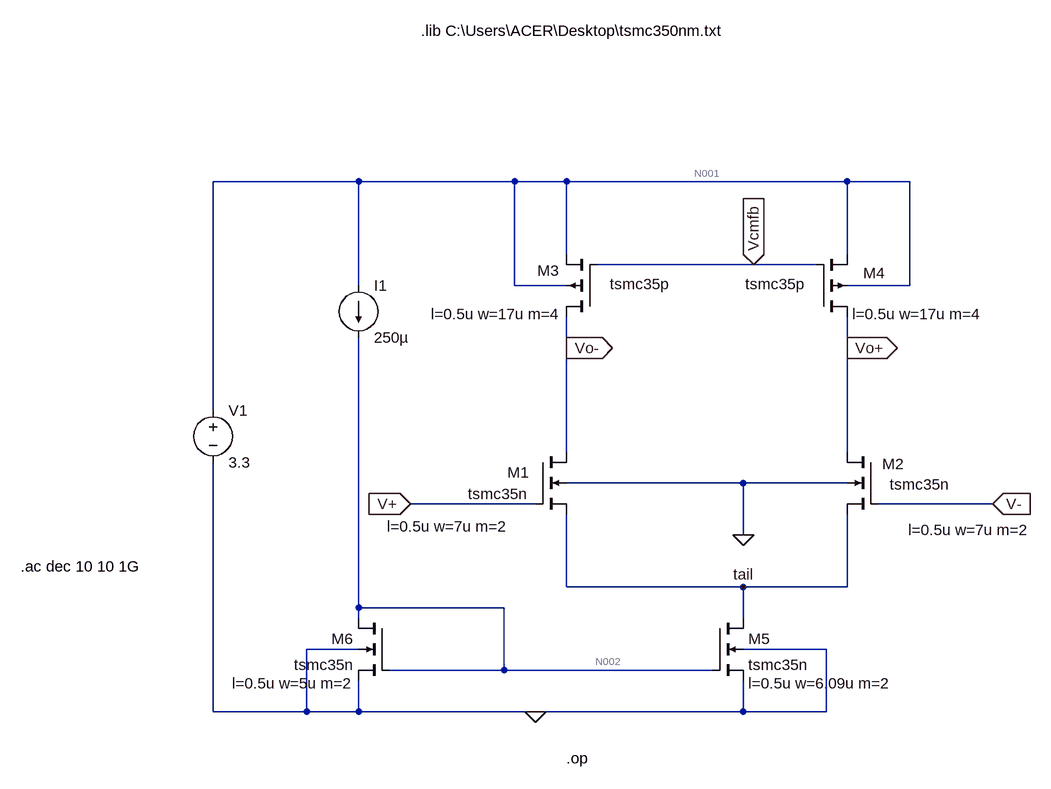
[diagram p0: schematic transconductor.asc]
transconductor.asc, the LTspice schematic file:
Version 4
SHEET 1 1708 2548
WIRE -560 -416 -784 -416
WIRE -320 -416 -560 -416
WIRE -240 -416 -320 -416
WIRE 192 -416 -240 -416
WIRE 288 -416 192 -416
WIRE -240 -304 -240 -416
WIRE 192 -304 192 -416
WIRE 48 -288 -192 -288
WIRE 144 -288 48 -288
WIRE -560 -256 -560 -416
WIRE -320 -256 -320 -416
WIRE -240 -256 -320 -256
WIRE 288 -256 288 -416
WIRE 288 -256 192 -256
WIRE -240 -160 -240 -208
WIRE 192 -160 192 -208
WIRE -784 -64 -784 -416
WIRE -240 0 -240 -160
WIRE 192 0 192 -160
WIRE 32 48 -240 48
WIRE 192 48 32 48
WIRE -288 80 -480 80
WIRE 416 80 240 80
WIRE 32 128 32 48
WIRE -240 208 -240 96
WIRE 32 208 -240 208
WIRE 192 208 192 96
WIRE 192 208 32 208
WIRE -560 240 -560 -176
WIRE -336 240 -560 240
WIRE -560 256 -560 240
WIRE 32 256 32 208
WIRE -560 304 -640 304
WIRE 160 304 32 304
WIRE -336 336 -336 240
WIRE -336 336 -512 336
WIRE -16 336 -336 336
WIRE -784 400 -784 16
WIRE -640 400 -640 304
WIRE -640 400 -784 400
WIRE -560 400 -560 352
WIRE -560 400 -640 400
WIRE -288 400 -560 400
WIRE 32 400 32 352
WIRE 32 400 -288 400
WIRE 160 400 160 304
WIRE 160 400 32 400
FLAG 32 128 0
FLAG -288 400 0
FLAG 32 208 tail
FLAG -480 80 V+
IOPIN -480 80 In
FLAG 416 80 V-
IOPIN 416 80 In
FLAG -240 -160 Vo-
IOPIN -240 -160 Out
FLAG 192 -160 Vo+
IOPIN 192 -160 Out
FLAG 48 -288 Vcmfb
IOPIN 48 -288 In
SYMBOL nmos4 -288 0 R0
WINDOW 123 -228 115 Left 2
WINDOW 0 -43 32 Left 2
WINDOW 3 -104 65 Left 2
SYMATTR Value2 l=0.5u w=7u m=2
SYMATTR InstName M1
SYMATTR Value tsmc35n
SYMBOL nmos4 240 0 M0
WINDOW 123 -233 120 Left 2
WINDOW 0 -40 19 Left 2
WINDOW 3 -109 50 Left 2
SYMATTR Value2 l=0.5u w=7u m=2
SYMATTR InstName M2
SYMATTR Value tsmc35n
SYMBOL pmos4 -192 -208 R180
WINDOW 123 56 4 Left 2
WINDOW 0 59 71 Left 2
WINDOW 3 -110 50 Left 2
SYMATTR Value2 l=0.5u w=17u m=4
SYMATTR InstName M3
SYMATTR Value tsmc35p
SYMBOL pmos4 144 -208 M180
WINDOW 123 56 4 Left 2
WINDOW 0 73 67 Left 2
WINDOW 3 -109 50 Left 2
SYMATTR Value2 l=0.5u w=17u m=4
SYMATTR InstName M4
SYMATTR Value tsmc35p
SYMBOL current -560 -256 R0
WINDOW 123 0 0 Left 0
WINDOW 39 0 0 Left 0
SYMATTR InstName I1
SYMATTR Value 250µ
SYMBOL nmos4 -16 256 R0
WINDOW 123 56 100 Left 2
SYMATTR Value2 l=0.5u w=6.09u m=2
SYMATTR InstName M5
SYMATTR Value tsmc35n
SYMBOL nmos4 -512 256 M0
WINDOW 123 56 100 Left 2
SYMATTR Value2 l=0.5u w=5u m=2
SYMATTR InstName M6
SYMATTR Value tsmc35n
SYMBOL voltage -784 -80 R0
WINDOW 123 0 0 Left 0
WINDOW 39 0 0 Left 0
SYMATTR InstName V1
SYMATTR Value 3.3
TEXT -1080 176 Left 2 !.ac dec 10 10 1G
TEXT -240 472 Left 2 !.op
TEXT -464 -648 Left 2 !.lib C:\\Users\\ACER\\Desktop\\tsmc350nm.txt

The netlist it stands for:
* transconductor.asc
M1 Vo- V+ tail 0 tsmc35n l=0.5u w=7u m=2
M2 Vo+ V- tail 0 tsmc35n l=0.5u w=7u m=2
M3 Vo- Vcmfb N001 N001 tsmc35p l=0.5u w=17u m=4
M4 Vo+ Vcmfb N001 N001 tsmc35p l=0.5u w=17u m=4
I1 N001 N002 250µ
M5 tail N002 0 0 tsmc35n l=0.5u w=6.09u m=2
M6 N002 N002 0 0 tsmc35n l=0.5u w=5u m=2
V1 N001 0 3.3
.model NMOS NMOS
.model PMOS PMOS
.lib standard.mos
.ac dec 10 10 1G
.op
.lib C:\Users\ACER\Desktop\tsmc350nm.txt
.backanno
.end

* Results of the author's LTspice run, read from the files saved beside the schematic
* Operating Point, zero values left out:
*   V(vo-) = 3.3 V
*   V(tail) = 6.156 nV
*   V(vo+) = 3.3 V
*   V(n001) = 3.3 V
*   V(n002) = 1.168 V
*   Id(M4) = -10.76 pA
*   Is(M4) = 10.76 pA
*   Id(M3) = -10.76 pA
*   Is(M3) = 10.76 pA
*   Id(M6) = 250 µA
*   Ib(M6) = -2.355 pA
*   Is(M6) = -250 µA
*   Id(M5) = 8.284 pA
*   Is(M5) = -8.284 pA
*   Id(M2) = 10.76 pA
*   Ib(M2) = -6.62 pA
*   Is(M2) = -4.142 pA
*   Id(M1) = 10.76 pA
*   Ib(M1) = -6.62 pA
*   Is(M1) = -4.142 pA
*   I(I1) = 250 µA
*   I(V1) = -250 µA
* From the log:
*   Semiconductor Device Operating Points:
*                           --- BSIM3 MOSFETS ---
*   Name:        m4          m3          m6          m5          m2
*   Model:     tsmc35p     tsmc35p     tsmc35n     tsmc35n     tsmc35n
*   Id:       -1.08e-11   -1.08e-11    2.50e-04    8.28e-12    1.08e-11
*   Vgs:      -3.30e+00   -3.30e+00    1.17e+00    1.17e+00   -6.16e-09
*   Vds:      -1.33e-09   -1.33e-09    1.17e+00    6.16e-09    3.30e+00
*   Vbs:       0.00e+00    0.00e+00    0.00e+00    0.00e+00   -6.16e-09
*   Vth:      -7.92e-01   -7.92e-01    7.40e-01    7.53e-01    7.28e-01
*   Vdsat:    -1.75e+00   -1.75e+00    3.00e-01    2.93e-01    3.91e-02
*   Gm:        2.48e-12    2.48e-12    1.07e-03    1.88e-11    8.31e-11
*   Gds:       8.08e-03    8.08e-03    2.20e-05    1.35e-03    2.73e-12
*   Gmb        1.17e-12    1.17e-12    2.65e-04    5.14e-12    3.70e-11
*   Cbd:       0.00e+00    0.00e+00    0.00e+00    0.00e+00    0.00e+00
*   Cbs:       0.00e+00    0.00e+00    0.00e+00    0.00e+00    0.00e+00
*   Cgsov:     1.25e-14    1.25e-14    2.63e-15    3.24e-15    4.02e-15
*   Cgdov:     1.25e-14    1.25e-14    2.63e-15    3.24e-15    4.02e-15
*   Cgbov:     2.00e-16    2.00e-16    9.06e-17    9.06e-17    9.06e-17
*   dQgdVgb:   1.54e-13    1.54e-13    2.07e-14    2.96e-14    1.86e-14
*   dQgdVdb:  -7.46e-14   -7.46e-14   -2.54e-15   -1.37e-14   -4.02e-15
*   dQgdVsb:  -7.68e-14   -7.68e-14   -1.66e-14   -1.51e-14   -4.02e-15
*   dQddVgb:  -7.68e-14   -7.68e-14   -8.85e-15   -1.47e-14   -4.02e-15
*   dQddVdb:   6.43e-14    6.43e-14    2.58e-15    1.28e-14    4.02e-15
*   dQddVsb:   2.61e-14    2.61e-14    8.12e-15    5.37e-15    6.37e-21
*   dQbdVgb:  -2.59e-16   -2.59e-16   -2.96e-15   -1.58e-16   -1.06e-14
*   dQbdVdb:  -4.14e-14   -4.14e-14    1.40e-17   -8.63e-15    2.18e-23
*   dQbdVsb:   1.20e-14    1.20e-14   -2.24e-15    1.12e-15    3.46e-19
*   Name:        m1
*   Model:     tsmc35n
*   Id:        1.08e-11
*   Vgs:      -6.16e-09
*   Vds:       3.30e+00
*   Vbs:      -6.16e-09
*   Vth:       7.28e-01
*   Vdsat:     3.91e-02
*   Gm:        8.31e-11
*   Gds:       2.73e-12
*   Gmb        3.70e-11
*   Cbd:       0.00e+00
*   Cbs:       0.00e+00
*   Cgsov:     4.02e-15
*   Cgdov:     4.02e-15
*   Cgbov:     9.06e-17
*   dQgdVgb:   1.86e-14
*   dQgdVdb:  -4.02e-15
*   dQgdVsb:  -4.02e-15
*   dQddVgb:  -4.02e-15
*   dQddVdb:   4.02e-15
*   dQddVsb:   6.37e-21
*   dQbdVgb:  -1.06e-14
*   dQbdVdb:   2.18e-23
*   dQbdVsb:   3.46e-19